# Altium schematic sheet PIC32ETH_Pic.SchDoc: Pic
size A2; SheetNumber: 2
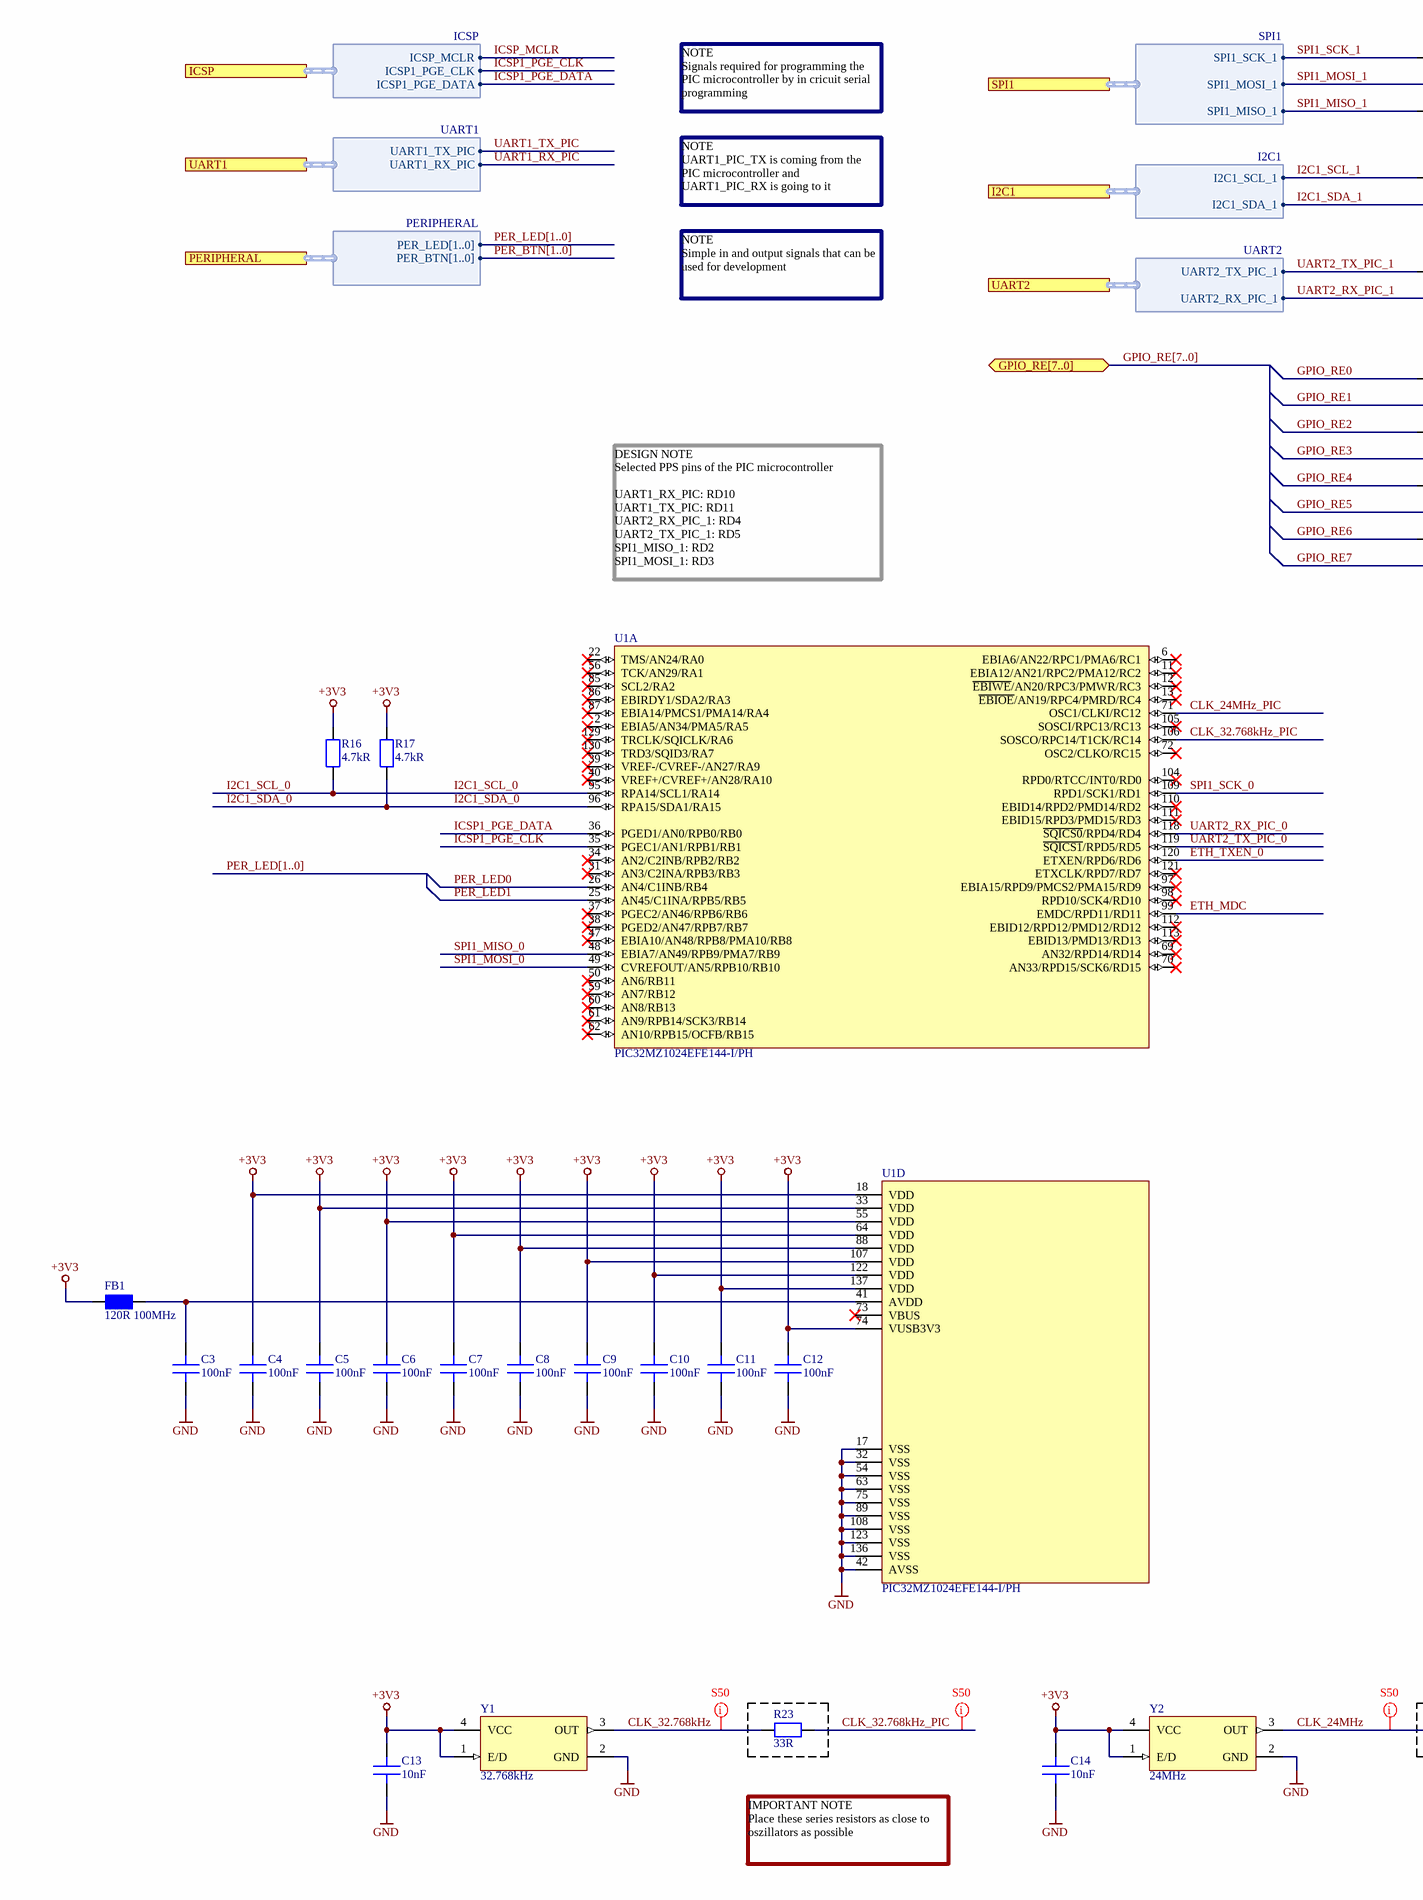
[diagram p0: PIC32ETH_Pic.SchDoc, left]
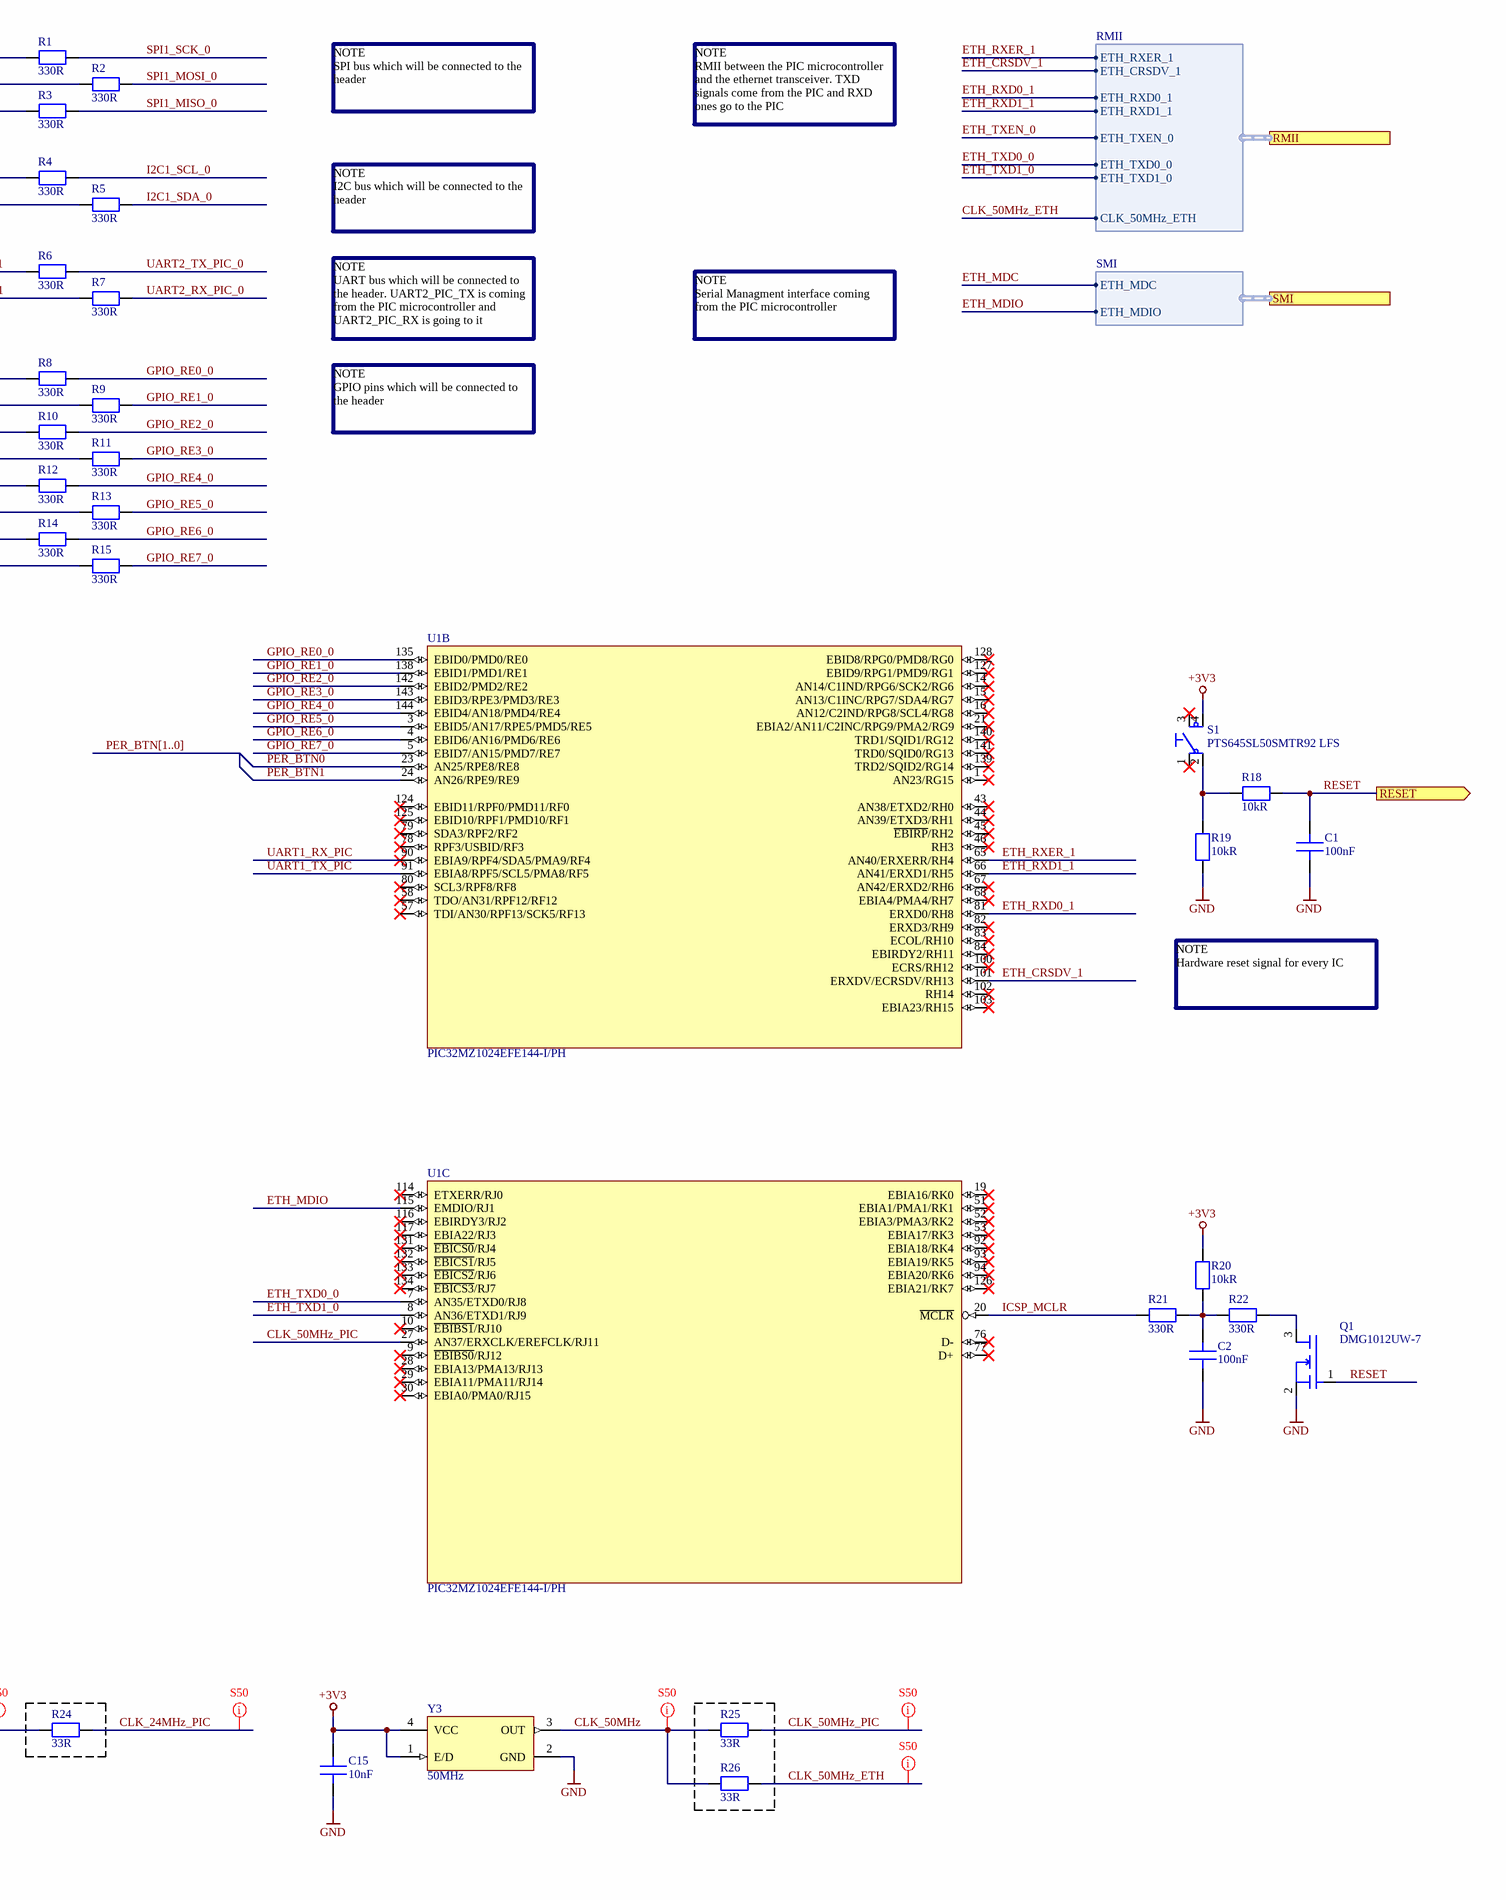
[diagram p1: PIC32ETH_Pic.SchDoc, right]

## Parts
C1  100nF  [C_CHIP2012N]
C2  100nF  [C_CHIP2012N]
C3  100nF  [C_CHIP2012N]
C4  100nF  [C_CHIP2012N]
C5  100nF  [C_CHIP2012N]
C6  100nF  [C_CHIP2012N]
C7  100nF  [C_CHIP2012N]
C8  100nF  [C_CHIP2012N]
C9  100nF  [C_CHIP2012N]
C10  100nF  [C_CHIP2012N]
C11  100nF  [C_CHIP2012N]
C12  100nF  [C_CHIP2012N]
C13  10nF  [C_CHIP2012N]
C14  10nF  [C_CHIP2012N]
C15  10nF  [C_CHIP2012N]
FB1  120R 100MHz  [FB_CHIP3216N]
Q1  DMG1012UW-7  [Q_SOT65P210X100-3N]
R1  330R  [R_CHIP2012N]
R2  330R  [R_CHIP2012N]
R3  330R  [R_CHIP2012N]
R4  330R  [R_CHIP2012N]
R5  330R  [R_CHIP2012N]
R6  330R  [R_CHIP2012N]
R7  330R  [R_CHIP2012N]
R8  330R  [R_CHIP2012N]
R9  330R  [R_CHIP2012N]
R10  330R  [R_CHIP2012N]
R11  330R  [R_CHIP2012N]
R12  330R  [R_CHIP2012N]
R13  330R  [R_CHIP2012N]
R14  330R  [R_CHIP2012N]
R15  330R  [R_CHIP2012N]
R16  4.7kR  [R_CHIP2012N]
R17  4.7kR  [R_CHIP2012N]
R18  10kR  [R_CHIP2012N]
R19  10kR  [R_CHIP2012N]
R20  10kR  [R_CHIP2012N]
R21  330R  [R_CHIP2012N]
R22  330R  [R_CHIP2012N]
R23  33R  [R_CHIP2012N]
R24  33R  [R_CHIP2012N]
R25  33R  [R_CHIP2012N]
R26  33R  [R_CHIP2012N]
S1  PTS645SL50SMTR92 LFS  [S_CHIPP620X620-4N]
U1  PIC32MZ1024EFE144-I/PH  [U_QFP40P1800X1800X120-144N]  (parts A,B,C,D of 4)
Y1  32.768kHz  [Y_CHIPP320X250-4N]
Y2  24MHz  [Y_CHIPP320X250-4N]
Y3  50MHz  [Y_CHIPP320X250-4N]

## Ports
GPIO_RE[7..0] (bidir), I2C1 (harness I2C1), ICSP (harness ICSP), PERIPHERAL (harness PERIPHERAL), RESET (out), RMII (harness RMII), SMI (harness SMI), SPI1 (harness SPI1), UART1 (harness UART1), UART2 (harness UART2)

## Harnesses
ICSP: ICSP_MCLR, ICSP1_PGE_DATA, ICSP1_PGE_CLK
UART1: UART1_RX_PIC, UART1_TX_PIC
UART2: UART2_RX_PIC_1, UART2_TX_PIC_1
SPI1: SPI1_MOSI_1, SPI1_SCK_1, SPI1_MISO_1
I2C1: I2C1_SDA_1, I2C1_SCL_1
PERIPHERAL: PER_BTN[1..0], PER_LED[1..0]
RMII: CLK_50MHz_ETH, ETH_RXER_1, ETH_TXEN_0, ETH_CRSDV_1, ETH_RXD0_1, ETH_RXD1_1, ETH_TXD1_0, ETH_TXD0_0
SMI: ETH_MDIO, ETH_MDC

## Nets
+3V3: C4.1 C5.1 C6.1 C7.1 C8.1 C9.1 C10.1 C11.1 C12.1 C13.2 C14.2 C15.2 FB1.1 R16.2 R17.2 R20.2 S1.4 U1.18(VDD) U1.33(VDD) U1.55(VDD) U1.64(VDD) U1.74(VUSB3V3) U1.88(VDD) U1.107(VDD) U1.122(VDD) U1.137(VDD) Y1.1(E/D) Y1.4(VCC) Y2.1(E/D) Y2.4(VCC) Y3.1(E/D) Y3.4(VCC)
GND: C1.2 C2.2 C3.2 C4.2 C5.2 C6.2 C7.2 C8.2 C9.2 C10.2 C11.2 C12.2 C13.1 C14.1 C15.1 Q1.2(S) R19.1 U1.17(VSS) U1.32(VSS) U1.42(AVSS) U1.54(VSS) U1.63(VSS) U1.75(VSS) U1.89(VSS) U1.108(VSS) U1.123(VSS) U1.136(VSS) Y1.2(GND) Y2.2(GND) Y3.2(GND)
CLK_24MHz: R24.1 Y2.3(OUT)
CLK_24MHz_PIC: R24.2 U1.71(OSC1/CLKI/RC12)
CLK_32.768kHz: R23.1 Y1.3(OUT)
CLK_32.768kHz_PIC: R23.2 U1.106(SOSCO/RPC14/T1CK/RC14)
CLK_50MHz: R25.1 R26.1 Y3.3(OUT)
CLK_50MHz_ETH: R26.2 ; port RMII.CLK_50MHz_ETH
CLK_50MHz_PIC: R25.2 U1.27(AN37/ERXCLK/EREFCLK/RJ11)
ETH_CRSDV_1: U1.101(ERXDV/ECRSDV/RH13) ; port RMII.ETH_CRSDV_1
ETH_MDC: U1.99(EMDC/RPD11/RD11) ; port SMI.ETH_MDC
ETH_MDIO: U1.115(EMDIO/RJ1) ; port SMI.ETH_MDIO
ETH_RXD0_1: U1.81(ERXD0/RH8) ; port RMII.ETH_RXD0_1
ETH_RXD1_1: U1.66(AN41/ERXD1/RH5) ; port RMII.ETH_RXD1_1
ETH_RXER_1: U1.65(AN40/ERXERR/RH4) ; port RMII.ETH_RXER_1
ETH_TXD0_0: U1.7(AN35/ETXD0/RJ8) ; port RMII.ETH_TXD0_0
ETH_TXD1_0: U1.8(AN36/ETXD1/RJ9) ; port RMII.ETH_TXD1_0
ETH_TXEN_0: U1.120(ETXEN/RPD6/RD6) ; port RMII.ETH_TXEN_0
GPIO_RE0: R8.1
GPIO_RE0_0: R8.2 U1.135(EBID0/PMD0/RE0)
GPIO_RE1: R9.1
GPIO_RE1_0: R9.2 U1.138(EBID1/PMD1/RE1)
GPIO_RE2: R10.1
GPIO_RE2_0: R10.2 U1.142(EBID2/PMD2/RE2)
GPIO_RE3: R11.1
GPIO_RE3_0: R11.2 U1.143(EBID3/RPE3/PMD3/RE3)
GPIO_RE4: R12.1
GPIO_RE4_0: R12.2 U1.144(EBID4/AN18/PMD4/RE4)
GPIO_RE5: R13.1
GPIO_RE5_0: R13.2 U1.3(EBID5/AN17/RPE5/PMD5/RE5)
GPIO_RE6: R14.1
GPIO_RE6_0: R14.2 U1.4(EBID6/AN16/PMD6/RE6)
GPIO_RE7: R15.1
GPIO_RE7_0: R15.2 U1.5(EBID7/AN15/PMD7/RE7)
I2C1_SCL_0: R4.2 R16.1 U1.95(RPA14/SCL1/RA14)
I2C1_SCL_1: R4.1 ; port I2C1.I2C1_SCL_1
I2C1_SDA_0: R5.2 R17.1 U1.96(RPA15/SDA1/RA15)
I2C1_SDA_1: R5.1 ; port I2C1.I2C1_SDA_1
ICSP1_PGE_CLK: U1.35(PGEC1/AN1/RPB1/RB1) ; port ICSP.ICSP1_PGE_CLK
ICSP1_PGE_DATA: U1.36(PGED1/AN0/RPB0/RB0) ; port ICSP.ICSP1_PGE_DATA
ICSP_MCLR: R21.1 U1.20(~{MCLR}) ; port ICSP.ICSP_MCLR
PER_BTN0: U1.23(AN25/RPE8/RE8)
PER_BTN1: U1.24(AN26/RPE9/RE9)
PER_LED0: U1.26(AN4/C1INB/RB4)
PER_LED1: U1.25(AN45/C1INA/RPB5/RB5)
RESET: C1.1 Q1.1(G) R18.1 ; port RESET
SPI1_MISO_0: R3.2 U1.48(EBIA7/AN49/RPB9/PMA7/RB9)
SPI1_MISO_1: R3.1 ; port SPI1.SPI1_MISO_1
SPI1_MOSI_0: R2.2 U1.49(CVREFOUT/AN5/RPB10/RB10)
SPI1_MOSI_1: R2.1 ; port SPI1.SPI1_MOSI_1
SPI1_SCK_0: R1.2 U1.109(RPD1/SCK1/RD1)
SPI1_SCK_1: R1.1 ; port SPI1.SPI1_SCK_1
UART1_RX_PIC: U1.90(EBIA9/RPF4/SDA5/PMA9/RF4) ; port UART1.UART1_RX_PIC
UART1_TX_PIC: U1.91(EBIA8/RPF5/SCL5/PMA8/RF5) ; port UART1.UART1_TX_PIC
UART2_RX_PIC_0: R7.2 U1.118(~{SQICS0}/RPD4/RD4)
UART2_RX_PIC_1: R7.1 ; port UART2.UART2_RX_PIC_1
UART2_TX_PIC_0: R6.2 U1.119(~{SQICS1}/RPD5/RD5)
UART2_TX_PIC_1: R6.1 ; port UART2.UART2_TX_PIC_1
NetC2_1: C2.1 R20.1 R21.2 R22.1
NetC3_1: C3.1 FB1.2 U1.41(AVDD)
NetQ1_3: Q1.3(D) R22.2
NetR18_2: R18.2 R19.2 S1.2

Not connected (* = marked no-connect by the designer): S1 1* 3*; U1 1(AN23/RG15)* 2(EBIA5/AN34/PMA5/RA5)* 6(EBIA6/AN22/RPC1/PMA6/RC1)* 9(~{EBIBS0}/RJ12)* 10(~{EBIBS1}/RJ10)* 11(EBIA12/AN21/RPC2/PMA12/RC2)* 12(~{EBIWE}/AN20/RPC3/PMWR/RC3)* 13(~{EBIOE}/AN19/RPC4/PMRD/RC4)* 14(AN14/C1IND/RPG6/SCK2/RG6)* 15(AN13/C1INC/RPG7/SDA4/RG7)* 16(AN12/C2IND/RPG8/SCL4/RG8)* 19(EBIA16/RK0)* 21(EBIA2/AN11/C2INC/RPG9/PMA2/RG9)* 22(TMS/AN24/RA0)* 28(EBIA13/PMA13/RJ13)* 29(EBIA11/PMA11/RJ14)* 30(EBIA0/PMA0/RJ15)* 31(AN3/C2INA/RPB3/RB3)* 34(AN2/C2INB/RPB2/RB2)* 37(PGEC2/AN46/RPB6/RB6)* 38(PGED2/AN47/RPB7/RB7)* 39(VREF-/CVREF-/AN27/RA9)* 40(VREF+/CVREF+/AN28/RA10)* 43(AN38/ETXD2/RH0)* 44(AN39/ETXD3/RH1)* 45(~{EBIRP}/RH2)* 46(RH3)* 47(EBIA10/AN48/RPB8/PMA10/RB8)* 50(AN6/RB11)* 51(EBIA1/PMA1/RK1)* 52(EBIA3/PMA3/RK2)* 53(EBIA17/RK3)* 56(TCK/AN29/RA1)* 57(TDI/AN30/RPF13/SCK5/RF13)* 58(TDO/AN31/RPF12/RF12)* 59(AN7/RB12)* 60(AN8/RB13)* 61(AN9/RPB14/SCK3/RB14)* 62(AN10/RPB15/OCFB/RB15)* 67(AN42/ERXD2/RH6)* 68(EBIA4/PMA4/RH7)* 69(AN32/RPD14/RD14)* 70(AN33/RPD15/SCK6/RD15)* 72(OSC2/CLKO/RC15)* 73(VBUS)* 76(D-)* 77(D+)* 78(RPF3/USBID/RF3)* 79(SDA3/RPF2/RF2)* 80(SCL3/RPF8/RF8)* 82(ERXD3/RH9)* 83(ECOL/RH10)* 84(EBIRDY2/RH11)* 85(SCL2/RA2)* 86(EBIRDY1/SDA2/RA3)* 87(EBIA14/PMCS1/PMA14/RA4)* 92(EBIA18/RK4)* 93(EBIA19/RK5)* 94(EBIA20/RK6)* 97(EBIA15/RPD9/PMCS2/PMA15/RD9)* 98(RPD10/SCK4/RD10)* 100(ECRS/RH12)* 102(RH14)* 103(EBIA23/RH15)* 104(RPD0/RTCC/INT0/RD0)* 105(SOSCI/RPC13/RC13)* 110(EBID14/RPD2/PMD14/RD2)* 111(EBID15/RPD3/PMD15/RD3)* 112(EBID12/RPD12/PMD12/RD12)* 113(EBID13/PMD13/RD13)* 114(ETXERR/RJ0)* 116(EBIRDY3/RJ2)* 117(EBIA22/RJ3)* 121(ETXCLK/RPD7/RD7)* 124(EBID11/RPF0/PMD11/RF0)* 125(EBID10/RPF1/PMD10/RF1)* 126(EBIA21/RK7)* 127(EBID9/RPG1/PMD9/RG1)* 128(EBID8/RPG0/PMD8/RG0)* 129(TRCLK/SQICLK/RA6)* 130(TRD3/SQID3/RA7)* 131(~{EBICS0}/RJ4)* 132(~{EBICS1}/RJ5)* 133(~{EBICS2}/RJ6)* 134(~{EBICS3}/RJ7)* 139(TRD2/SQID2/RG14)* 140(TRD1/SQID1/RG12)* 141(TRD0/SQID0/RG13)*

## Buses and harness runs
bus GPIO_RE[7..0] = port GPIO_RE[7..0]
bus PER_BTN[1..0]
bus PER_LED[1..0]

## Layout directives
net class IMPEDANCE_S50: CLK_24MHz, CLK_24MHz_PIC, CLK_32.768kHz, CLK_32.768kHz_PIC, CLK_50MHz, CLK_50MHz_ETH, CLK_50MHz_PIC

## Notes on the sheet
- NOTE
  Signals required for programming the PIC microcontroller by in cricuit serial programming
- NOTE
  SPI bus which will be connected to the header
- NOTE
  RMII between the PIC microcontroller and the ethernet transceiver. TXD signals come from the PIC and RXD ones go to the PIC
- NOTE
  UART1_PIC_TX is coming from the PIC microcontroller and UART1_PIC_RX is going to it
- NOTE
  I2C bus which will be connected to the header
- NOTE
  Simple in and output signals that can be used for development
- NOTE
  UART bus which will be connected to the header. UART2_PIC_TX is coming from the PIC microcontroller and UART2_PIC_RX is going to it
- NOTE
  Serial Managment interface coming from the PIC microcontroller
- NOTE
  GPIO pins which will be connected to the header
- DESIGN NOTE
  Selected PPS pins of the PIC microcontroller
  UART1_RX_PIC: RD10
  UART1_TX_PIC: RD11
  UART2_RX_PIC_1: RD4
  UART2_TX_PIC_1: RD5
  SPI1_MISO_1: RD2
  SPI1_MOSI_1: RD3
- NOTE
  Hardware reset signal for every IC
- IMPORTANT NOTE
  Place these series resistors as close to oszillators as possible
- Rev:
- Project:
- Doc Nr:
- File:
- Drawn:
- Date:
- Size:
- Sheet:
- A2
- of

## Library data of the parts
C1-C12 = C_C0805C104K5RACTU: C CERAMIC 100nF 50V 10% 2012; Manufacturer: Kemet; Dielectric: X7R; Tolerance: +/-10%; Datasheet Url: https://content.kemet.com/datasheets/KEM_C1002_X7R_SMD.pdf; Mounting: SMT; Package: 2012; Part Number: C0805C104K5RACTU; Price: 0.23; Price Currency: CHF; Supplier 1: Digi-Key; Capacitance: 100nF; Voltage: 50V; Supplier Part Number 1: 399-1170-1-ND; Esr: n/a; Pin Count: 2; Temperature Range: -55degC to 125degC
C13-C15 = C_C0805C103K5RACTU: C CERAMIC 10nF 50V 10% 2012; Manufacturer: Kemet; Dielectric: X7R; Tolerance: +/-10%; Datasheet Url: https://content.kemet.com/datasheets/KEM_C1002_X7R_SMD.pdf; Mounting: SMT; Package: 2012; Part Number: C0805C103K5RACTU; Price: 0.18; Price Currency: CHF; Supplier 1: Digi-Key; Capacitance: 10nF; Voltage: 50V; Supplier Part Number 1: 399-1158-1-ND; Esr: n/a; Pin Count: 2; Temperature Range: -55degC to 125degC
FB1 = FB_BLM31KN121SN1L: FB 120R 100MHz 6A 3216; Manufacturer: Murata Electronics; Resistance: 9mR; Datasheet Url: https://www.murata.com/en-us/products/productdata/8801529331742/ENFA0091.pdf; Mounting: SMT; Package: 3216; Part Number: BLM31KN121SN1L; Price: 0.29; Price Currency: CHF; Supplier 1: Digi-Key; Supplier Part Number 1: 490-16524-1-ND; Temperature Range: -55degC to 125degC; Pin Count: 2; Current: 6A; Impedance: 120R 100MHz
Q1 = Q_DMG1012UW-7: Q MOSFET N-CH 20V 1A SOT-323; Manufacturer: Diodes Incorporated; Power: 290mW; Voltage Gate Source: +/-6V; Datasheet Url: https://www.diodes.com/assets/Datasheets/ds31859.pdf; Mounting: SMT; Package: SOT-323; Part Number: DMG1012UW-7; Price: 0.39; Price Currency: CHF; Supplier 1: Digi-Key; Supplier Part Number 1: DMG1012UW-7DICT-ND; Current Drain: 1A; Pin Count: 3; Temperature Range: -55degC to 150degC; Voltage Drain Source: 20V; Mosfet Type: N-CH
R1-R15 R21 R22 = R_RMCF0805FT330R: R SMT 330R 1% 125mW 2012; Manufacturer: Stackpole Electronics Inc; Temperature Coefficient: 100ppm/degC; Tolerance: +/-1%; Voltage: 150V; Datasheet Url: https://www.seielect.com/catalog/sei-rmcf_rmcp.pdf; Mounting: SMT; Package: 2012; Part Number: RMCF0805FT330R; Price: 0.10; Price Currency: CHF; Supplier 1: Digi-Key; Resistance: 330R; Supplier Part Number 1: RMCF0805FT330RCT-ND; Temperature Range: -55degC to 155degC; Pin Count: 2; Power: 125mW
R16 R17 = R_RMCF0805FT4K70: R SMT 4.7kR 1% 125mW 2012; Manufacturer: Stackpole Electronics Inc; Temperature Coefficient: 100ppm/degC; Tolerance: +/-1%; Voltage: 150V; Datasheet Url: https://www.seielect.com/catalog/sei-rmcf_rmcp.pdf; Mounting: SMT; Package: 2012; Part Number: RMCF0805FT4K70; Price: 0.10; Price Currency: CHF; Supplier 1: Digi-Key; Resistance: 4.7kR; Supplier Part Number 1: RMCF0805FT4K70CT-ND; Temperature Range: -55degC to 155degC; Pin Count: 2; Power: 125mW
R18-R20 = R_RMCF0805FT10K0: R SMT 10kR 1% 125mW 2012; Manufacturer: Stackpole Electronics Inc; Temperature Coefficient: 100ppm/degC; Tolerance: +/-1%; Voltage: 150V; Datasheet Url: https://www.seielect.com/catalog/sei-rmcf_rmcp.pdf; Mounting: SMT; Package: 2012; Part Number: RMCF0805FT10K0; Price: 0.10; Price Currency: CHF; Supplier 1: Digi-Key; Resistance: 10kR; Power: 125mW; Supplier Part Number 1: RMCF0805FT10K0CT-ND; Pin Count: 2; Temperature Range: -55degC to 155degC
R23-R26 = R_RMCF0805FT33R0: R SMT 33R 1% 125mW 2012; Manufacturer: Stackpole Electronics Inc; Temperature Coefficient: 100ppm/degC; Tolerance: +/-1%; Voltage: 150V; Datasheet Url: https://www.seielect.com/catalog/sei-rmcf_rmcp.pdf; Mounting: SMT; Package: 2012; Part Number: RMCF0805FT33R0; Price: 0.10; Price Currency: CHF; Supplier 1: Digi-Key; Resistance: 33R; Supplier Part Number 1: RMCF0805FT33R0CT-ND; Temperature Range: -55degC to 155degC; Pin Count: 2; Power: 125mW
S1 = S_PTS645SL50SMTR92LFS: S TACTILE SPST-NO 12V 50mA SMT; Manufacturer: C&K; Cycles Mechanical: 100000; Datasheet Url: https://dznh3ojzb2azq.cloudfront.net/products/Tactile/PTS645/documents/datasheet.pdf; Mounting: SMT; Package: n/a; Part Number: PTS645SL50SMTR92 LFS; Price: 0.30; Price Currency: CHF; Supplier 1: Digi-Key; Pin Count: 4; Temperature Range: -20degC to 60degC; Supplier Part Number 1: CKN9088CT-ND; Current: 50mA; Cycles Electrical: n/a; Voltage: 12V; Switch Type: SPST-NO
U1 = U_PIC32MZ1024EFE144-I/PH: U MCU 32BIT 1MB 144-TQFP; Manufacturer: Microchip Technology; Bit Count: 32; Voltage Input: 2.1V to 3.6V; Current Output: 5mA; Datasheet Url: https://www.mouser.ch/datasheet/2/268/mchp_s_a0007771640_1-2274641.pdf; Mounting: SMT; Package: 144-TQFP; Part Number: PIC32MZ1024EFE144-I/PH; Price: 13.12; Price Currency: CHF; Supplier 1: Mouser; Pin Count: 144; Supplier Part Number 1: 579-MZ1024EFE144IPH; Temperature Range: -40degC to 85degC; Memory Size: 1MB
Y1 = Y_ECS-327ATQMV-AS-TR: Y OSCILLATOR 32.768kHz CMOS SMT; Manufacturer: ECS Inc.; Current: 200uA; Voltage: 1.62V to 3.63V; Part Number: ECS-327ATQMV-AS-TR; Price Currency: CHF; Datasheet Url: https://ecsxtal.com/store/pdf/ECS-327ATQMV.pdf; Mounting: SMT; Package: n/a; Pin Count: 4; Price: 1.27; Temperature Range: -40degC to 125degC; Frequency: 32.768kHz; Supplier 1: Digi-Key; Supplier Part Number 1: XC2826CT-ND; Technology: CMOS
Y2 = Y_ECS-3225MV-240-CN-TR: Y OSCILLATOR 24MHz HCMOS SMT; Manufacturer: ECS Inc.; Current: 4mA; Voltage: 1.62V to 3.63V; Part Number: ECS-3225MV-240-CN-TR; Price Currency: CHF; Datasheet Url: https://ecsxtal.com/store/pdf/ECS-3225MV.pdf; Mounting: SMT; Package: n/a; Pin Count: 4; Price: 1.20; Temperature Range: -40degC to 85degC; Frequency: 24MHz; Supplier 1: Digi-Key; Supplier Part Number 1: XC2884CT-ND; Technology: HCMOS
Y3 = Y_ECS-3225MV-500-BN-TR: Y OSCILLATOR 50MHz HCMOS SMT; Manufacturer: ECS Inc.; Current: 5mA; Voltage: 1.62V to 3.63V; Part Number: ECS-3225MV-500-BN-TR; Price Currency: CHF; Datasheet Url: https://ecsxtal.com/store/pdf/ECS-3225MV.pdf; Mounting: SMT; Package: n/a; Pin Count: 4; Price: 1.21; Temperature Range: -40degC to 85degC; Frequency: 50MHz; Supplier 1: Digi-Key; Supplier Part Number 1: XC2881CT-ND; Technology: HCMOS